# Altium schematic sheet TSALLATCH.SchDoc
size A4; SheetNumber: 1; SheetTotal: 1
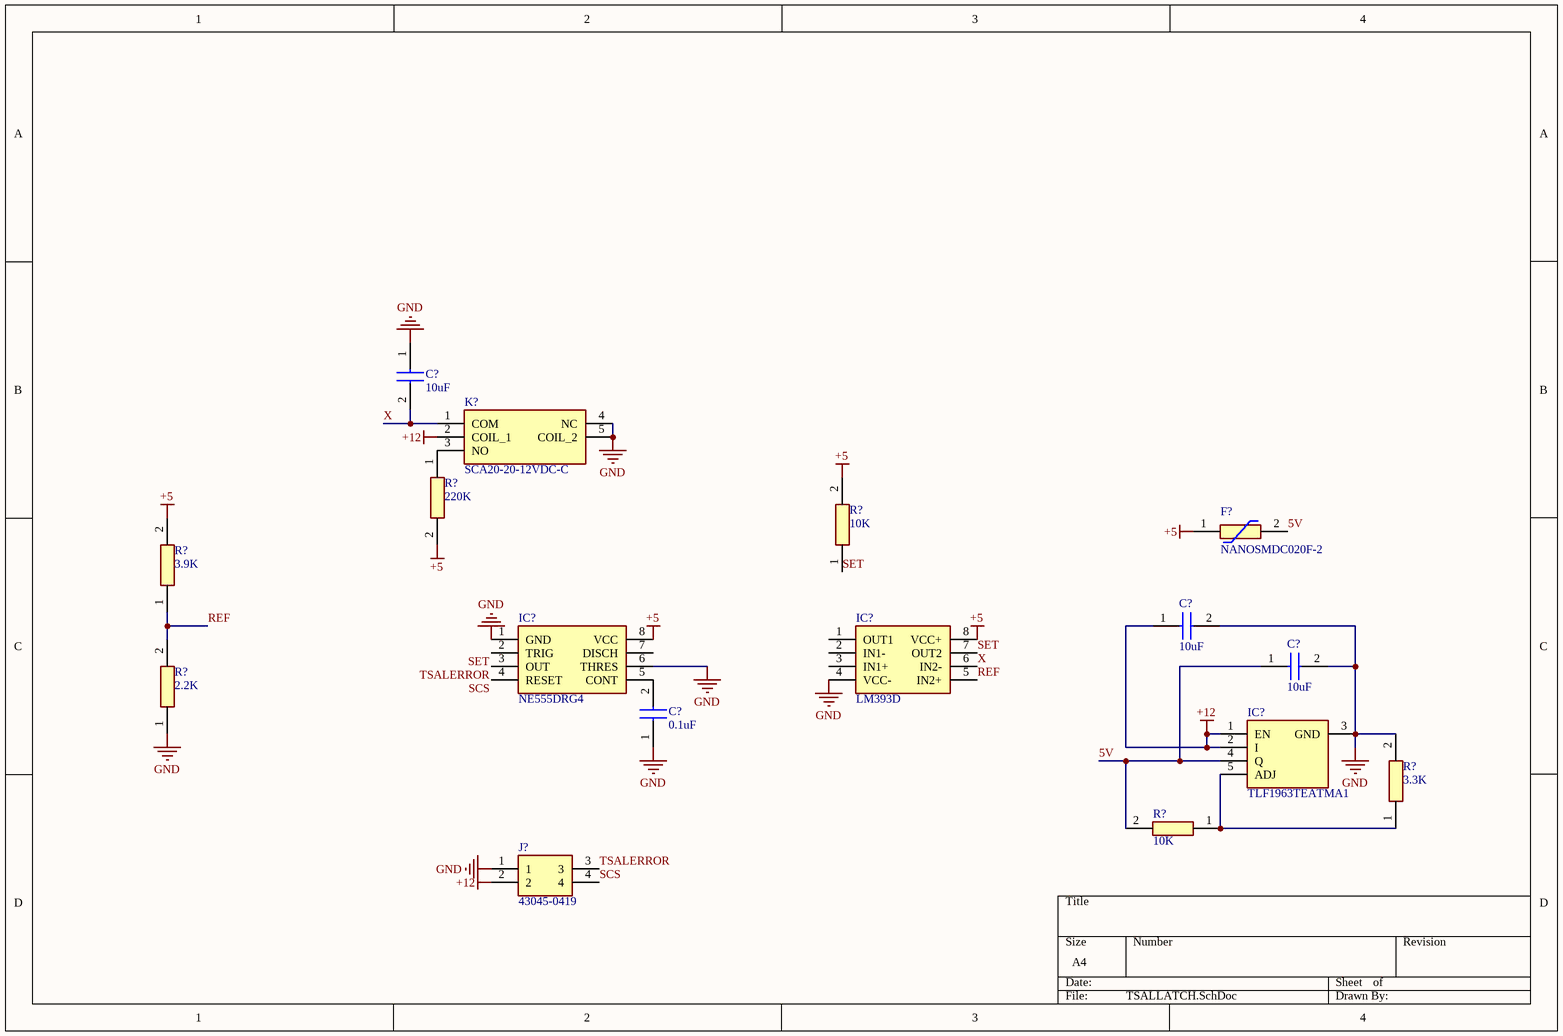
[diagram p0: TSALLATCH.SchDoc]

## Parts
(Parts that share a designator on the sheet are numbered #1, #2 ... from top to bottom, then left to right.)
C?#1  10uF  [CAPC3225X88N]
C?#2  10uF  [CAPC3225X88N]
C?#3  10uF  [CAPC3225X88N]
C?#4  0.1uF  [CAPC3225X88N]
F?  NANOSMDC020F-2  [NANOSMDC016F2]
IC?#1  NE555DRG4  [SOIC127P600X175-8N]
IC?#2  LM393D  [SOIC127P600X175-8N]
IC?#3  TLF1963TEATMA1  [TLF1963TEATMA1]
J?  43045-0419  [43045-04YY_181920]
K?  SCA20-20-12VDC-C  [SCA202012VDCC]
R?#1  220K  [RESC3126X60N]
R?#2  10K  [RESC3126X60N]
R?#3  3.9K  [RESC3126X60N]
R?#4  2.2K  [RESC3126X60N]
R?#5  10K  [RESC3126X60N]
R?#6  3.3K  [RESC3126X60N]

## Nets
+5: F?.1 IC?#1.8(VCC) IC?#2.8(VCC+) R?#1.2 R?#2.2 R?#3.2
+12: C?#2.1 IC?#3.1(EN) IC?#3.2(I) J?.2 K?.2(COIL_1)
GND: C?#1.1 C?#2.2 C?#3.2 C?#4.1 IC?#1.1(GND) IC?#1.6(THRES) IC?#2.4(VCC-) IC?#3.3(GND) J?.1 K?.4(NC) K?.5(COIL_2) R?#4.1 R?#6.2
5V: C?#3.1 F?.2 IC?#3.4(Q) R?#5.2
REF: IC?#2.5(IN2+) R?#3.1 R?#4.2
SCS: IC?#1.4(RESET) J?.4
SET: IC?#1.2(TRIG) IC?#2.7(OUT2) R?#2.1
TSALERROR: IC?#1.3(OUT) J?.3
X: C?#1.2 IC?#2.6(IN2-) K?.1(COM)
NetC?#4_2: C?#4.2 IC?#1.5(CONT)
NetIC?#3_5: IC?#3.5(ADJ) R?#5.1 R?#6.1
NetK?_3: K?.3(NO) R?#1.1

Not connected (* = marked no-connect by the designer): IC?#1 7(DISCH); IC?#2 1(OUT1) 2(IN1-) 3(IN1+)

## Library data of the parts
C?#1-C?#4 = C1210C273KARACTU: Capacitor; Manufacturer_Name: Kemet; Datasheet Link: https://content.kemet.com/datasheets/KEM_C1011_X7R_TIP_RING_SMD.pdf; Height: 0.88mm; Manufacturer_Part_Number: C1210C273KARACTU; Mouser Part Number: 80-C1210C273KAR; Mouser Price/Stock: https://www.mouser.co.uk/ProductDetail/KEMET/C1210C273KARACTU?qs=iK5Mdz3fWPgSn%252Bljrz49ZA%3D%3D
F? = NANOSMDC020F-2: Resettable Fuse; Manufacturer_Name: LITTELFUSE; Datasheet Link: https://www.littelfuse.com/~/media/electronics/datasheets/resettable_ptcs/littelfuse_ptc_nanosmdc_datasheet.pdf.pdf; Height: 1mm; Manufacturer_Part_Number: NANOSMDC020F-2; Mouser Part Number: 650-NANOSMDC020F-2; Mouser Price/Stock: https://www.mouser.co.uk/ProductDetail/Littelfuse/NANOSMDC020F-2?qs=iK0evp%252BCRRU6agwMt7HYjg%3D%3D; Arrow Part Number: NANOSMDC020F-2; Arrow Price/Stock: https://www.arrow.com/en/products/nanosmdc020f-2/littelfuse
IC?#1 = NE555DRG4: Integrated Circuit; Manufacturer_Name: Texas Instruments; Datasheet Link: http://www.mouser.com/ds/2/405/ne555-557499.pdf; Height: 1.75mm; Manufacturer_Part_Number: NE555DRG4; Mouser Part Number: 595-NE555DRG4; Mouser Price/Stock: https://www.mouser.co.uk/ProductDetail/Texas-Instruments/NE555DRG4?qs=rLYyFdxB%2FmreBHawQCpQ0Q%3D%3D; Arrow Part Number: NE555DRG4; Arrow Price/Stock: https://www.arrow.com/en/products/ne555drg4/texas-instruments?region=nac
IC?#2 = LM393D: Integrated Circuit; Manufacturer_Name: STMicroelectronics; Datasheet Link: http://www.st.com/st-web-ui/static/active/en/resource/technical/document/datasheet/CD00000465.pdf; Height: 1.75mm; Manufacturer_Part_Number: LM393D; Mouser Part Number: 511-LM393D; Mouser Price/Stock: https://www.mouser.co.uk/ProductDetail/STMicroelectronics/LM393D?qs=htKRmzjvioSpfPyLiLnV1A%3D%3D; Arrow Part Number: LM393D; Arrow Price/Stock: https://www.arrow.com/en/products/lm393d/stmicroelectronics?region=europe
IC?#3 = TLF1963TEATMA1: Integrated Circuit; Manufacturer_Name: Infineon; Datasheet Link: https://www.infineon.com/dgdl/Infineon-TLF1963-DS-v01_00-EN.pdf?fileId=5546d46258fc0bc1015969d2981941e0; Height: 2.35mm; Manufacturer_Part_Number: TLF1963TEATMA1; Mouser Part Number: 726-TLF1963TEATMA1; Mouser Price/Stock: https://www.mouser.co.uk/ProductDetail/Infineon-Technologies/TLF1963TEATMA1?qs=SiyfpgnvCZluIGE%2FbZiglw%3D%3D; Arrow Part Number: TLF1963TEATMA1; Arrow Price/Stock: https://www.arrow.com/en/products/tlf1963teatma1/infineon-technologies-ag?region=nac
J? = 43045-0419: Connector; Manufacturer_Name: Molex; Datasheet Link: https://www.molex.com/pdm_docs/sd/430450218_sd.pdf; Height: 9.91mm; Manufacturer_Part_Number: 43045-0419; Mouser Part Number: 538-43045-0419; Mouser Price/Stock: https://www.mouser.co.uk/ProductDetail/Molex/43045-0419?qs=UeCeOHRHQebVNIQyI9VWWg%3D%3D
K? = SCA20-20-12VDC-C: Relay or Contactor; Manufacturer_Name: LEONE; Datasheet Link: https://www.kuraelectronics.com/new-pdf/SCA%2020.pdf; Height: 13.7mm; Manufacturer_Part_Number: SCA20-20-12VDC-C
R?#1-R?#6 = RC1210JR-070RL: Resistor; Manufacturer_Name: YAGEO (PHYCOMP); Datasheet Link: https://datasheet.datasheetarchive.com/originals/distributors/Datasheets_SAMA/902f9e387b938f871d31120f5fc1d65e.pdf; Height: 0.6mm; Manufacturer_Part_Number: RC1210JR-070RL; Mouser Part Number: 603-RC1210JR-070RL; Mouser Price/Stock: https://www.mouser.co.uk/ProductDetail/YAGEO/RC1210JR-070RL?qs=eVUp2xEqV%2FtpfK61W3Q4CQ%3D%3D; Arrow Part Number: RC1210JR-070RL; Arrow Price/Stock: https://www.arrow.com/en/products/rc1210jr-070rl/yageo